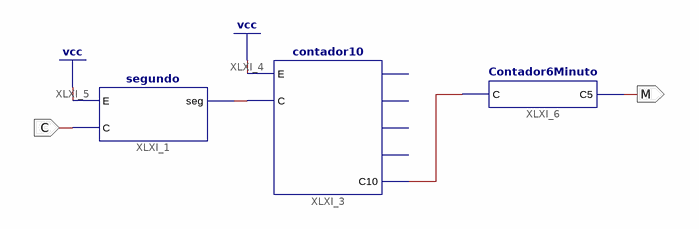
[diagram p0: schematic sheet 1]
// Xilinx ISE schematic minuto.sch (spartan3e) as structural Verilog: 3 symbols, 2 ports
module minuto (
  input  C,
  output M
);

  wire XLXN_1, XLXN_5;

  segundo XLXI_1 (.C(C), .E(1'b1), .seg(XLXN_1));
  contador10 XLXI_3 (.C(XLXN_1), .C10(XLXN_5), .E(1'b1));  // open: Q0, Q1, Q2, Q3
  Contador6Minuto XLXI_6 (.C(XLXN_5), .C5(M));
endmodule
